# Altium schematic sheet RHR047A_sch3_Processor_5.SchDoc
size 431 x 279 mm; SheetNumber: 3; PageSetup: Record=PageOptions|CenterHorizontal=True|CenterVertical=True|PrintScale=0.96|XCorrection=1.00|YCorrection=1.00|PrintKind=1|BorderSize=5000000|LeftOffset=0|BottomOffset=0|Orientation=2|PaperLength=1000|PaperWidth=1000|Scale=100|PaperSource=258|PrintQuality=600|MediaType=1|DitherType=10|PaperKind=11x17|PrintScaleMode=1; CopyrightDate: 20xx
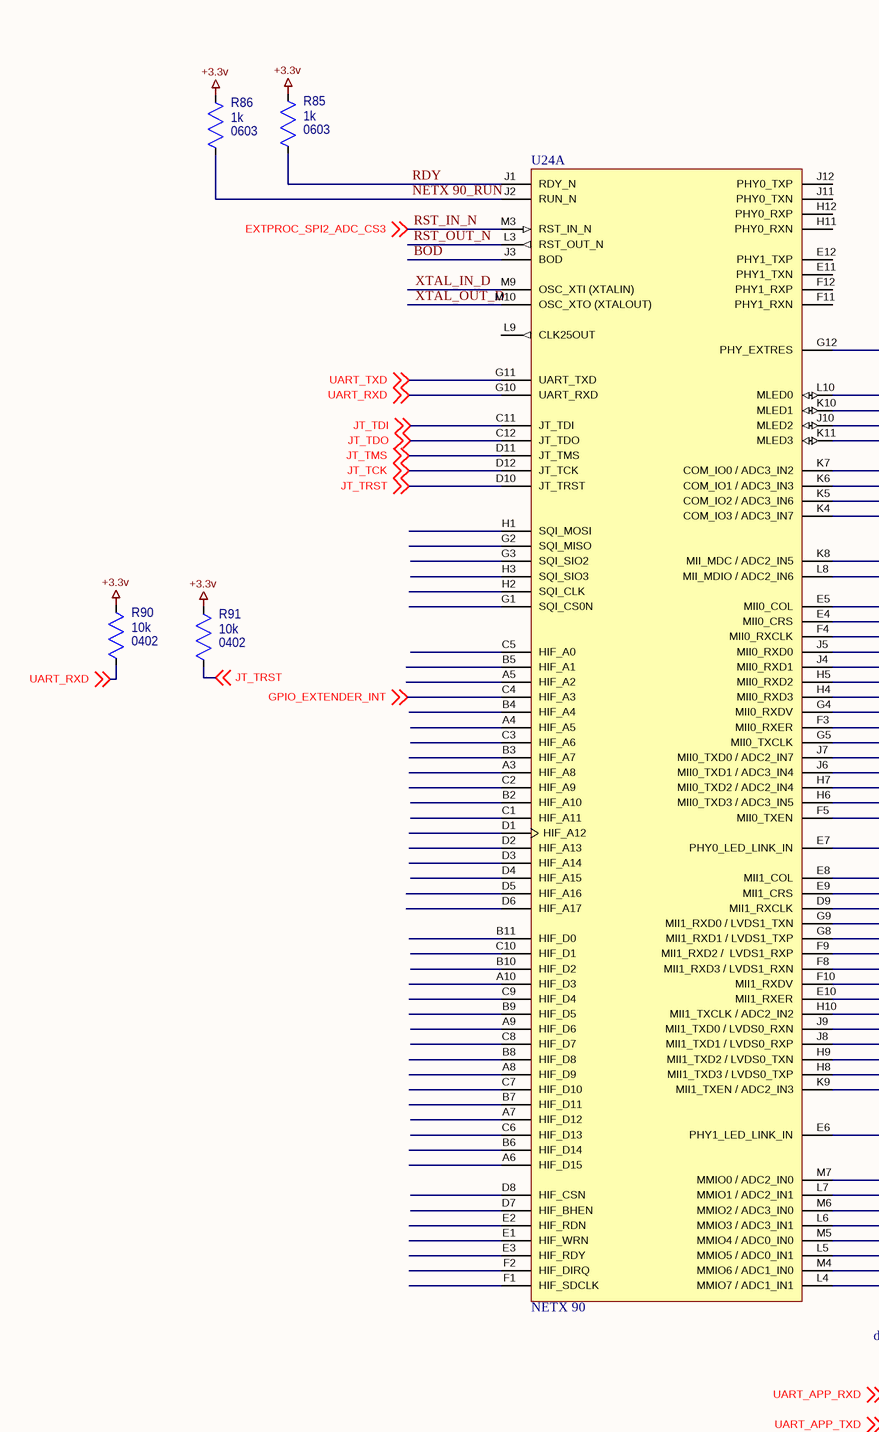
[diagram p0: RHR047A_sch3_Processor_5.SchDoc, left]
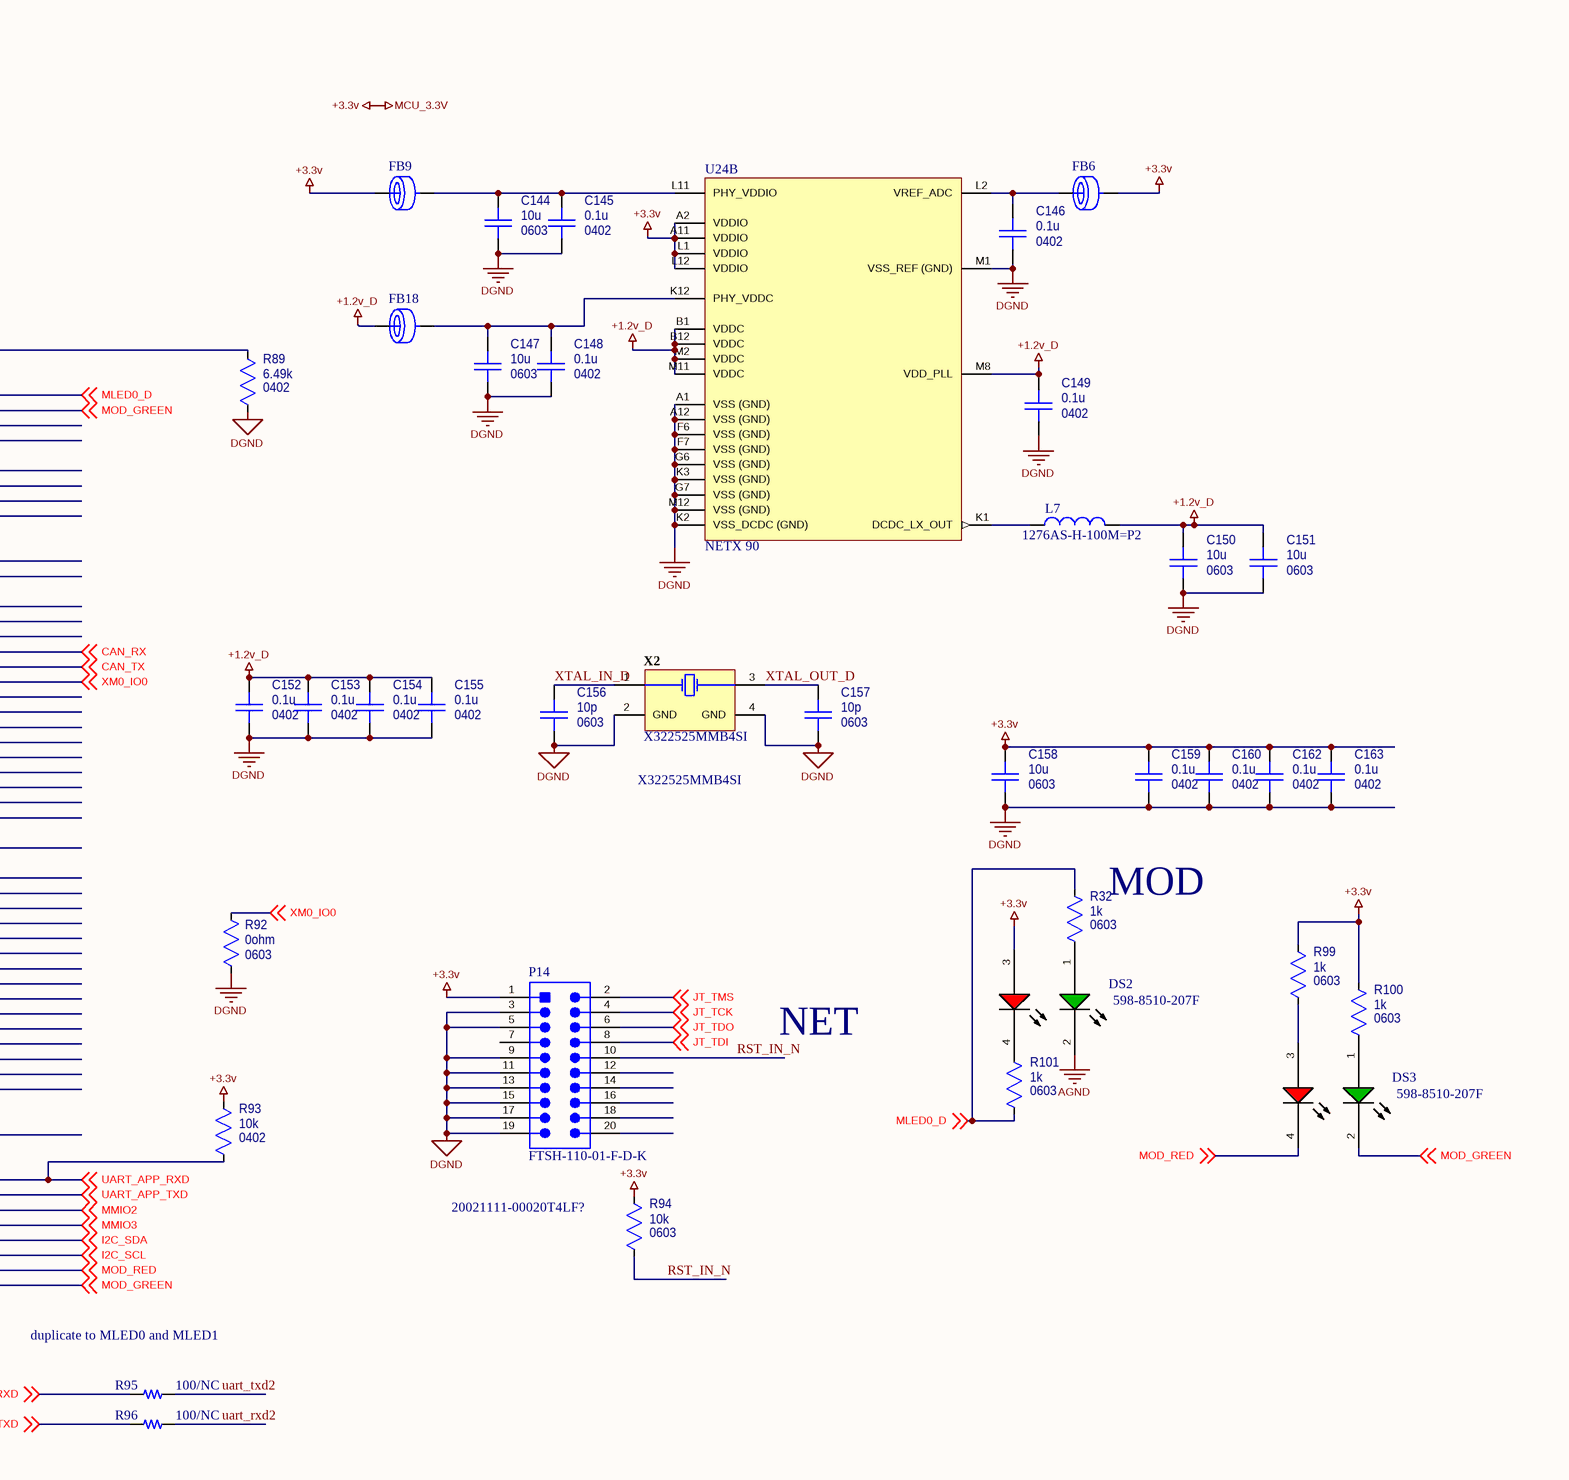
[diagram p1: RHR047A_sch3_Processor_5.SchDoc, right]

## Parts
C144  value 10u  Package: 0603  [CAPC1608X092N_0603]  (hidden comment: Capacitor_0603)
C145  value 0.1u  Package: 0402  [CAPC1005X056N_0402]  (hidden comment: Capacitor_0402)
C146  value 0.1u  Package: 0402  [CAPC1005X056N_0402]  (hidden comment: Capacitor_0402)
C147  value 10u  Package: 0603  [CAPC1608X092N_0603]  (hidden comment: Capacitor_0603)
C148  value 0.1u  Package: 0402  [CAPC1005X056N_0402]  (hidden comment: Capacitor_0402)
C149  value 0.1u  Package: 0402  [CAPC1005X056N_0402]  (hidden comment: Capacitor_0402)
C150  value 10u  Package: 0603  [CAPC1608X092N_0603]  (hidden comment: Capacitor_0603)
C151  value 10u  Package: 0603  [CAPC1608X092N_0603]  (hidden comment: Capacitor_0603)
C152  value 0.1u  Package: 0402  [CAPC1005X056N_0402]  (hidden comment: Capacitor_0402)
C153  value 0.1u  Package: 0402  [CAPC1005X056N_0402]  (hidden comment: Capacitor_0402)
C154  value 0.1u  Package: 0402  [CAPC1005X056N_0402]  (hidden comment: Capacitor_0402)
C155  value 0.1u  Package: 0402  [CAPC1005X056N_0402]  (hidden comment: Capacitor_0402)
C156  value 10p  Package: 0603  [CAPC1608X092N_0603]  (hidden comment: Capacitor_0603)
C157  value 10p  Package: 0603  [CAPC1608X092N_0603]  (hidden comment: Capacitor_0603)
C158  value 10u  Package: 0603  [CAPC1608X092N_0603]  (hidden comment: Capacitor_0603)
C159  value 0.1u  Package: 0402  [CAPC1005X056N_0402]  (hidden comment: Capacitor_0402)
C160  value 0.1u  Package: 0402  [CAPC1005X056N_0402]  (hidden comment: Capacitor_0402)
C162  value 0.1u  Package: 0402  [CAPC1005X056N_0402]  (hidden comment: Capacitor_0402)
C163  value 0.1u  Package: 0402  [CAPC1005X056N_0402]  (hidden comment: Capacitor_0402)
DS2  598-8510-207F  [DIAL-1208-4_V]
DS3  598-8510-207F  [DIAL-1208-4_V]
FB6  FBC0603  [FBC0603]  (value not drawn)
FB9  FBC0603  [FBC0603]  (value not drawn)
FB18  FBC0603  [FBC0603]  (value not drawn)
L7  1276AS-H-100M=P2  [MURA-IND1210_V]
P14  FTSH-110-01-F-D-K  [SMTC-FTSH-110-01-F-D-K_V]
R32  value 1k  Package: 0603  [RESC1608X055N_0603]  (hidden comment: Resistor_0603)
R85  value 1k  Package: 0603  [RESC1608X055N_0603]  (hidden comment: Resistor_0603)
R86  value 1k  Package: 0603  [RESC1608X055N_0603]  (hidden comment: Resistor_0603)
R89  value 6.49k  Package: 0402  [RESC1005X040N_0402]  (hidden comment: Resistor_0402)
R90  value 10k  Package: 0402  [RESC1005X040N_0402]  (hidden comment: Resistor_0402)
R91  value 10k  Package: 0402  [RESC1005X040N_0402]  (hidden comment: Resistor_0402)
R92  value 0ohm  Package: 0603  [RESC1608X055N_0603]  (hidden comment: Resistor_0603)
R93  value 10k  Package: 0402  [RESC1005X040N_0402]  (hidden comment: Resistor_0402)
R94  value 10k  Package: 0603  [RESC1608X055N_0603]  (hidden comment: Resistor_0603)
R95  100/NC  [0603R]
R96  100/NC  [0603R]
R99  value 1k  Package: 0603  [RESC1608X055N_0603]  (hidden comment: Resistor_0603)
R100  value 1k  Package: 0603  [RESC1608X055N_0603]  (hidden comment: Resistor_0603)
R101  value 1k  Package: 0603  [RESC1608X055N_0603]  (hidden comment: Resistor_0603)
U24  NETX 90  [HILSCH-LFBGA144_V]  (parts A,B of 2)
X2  X322525MMB4SI  [TXC-7M-4_V]

## Nets
+1.2v_D: C149.1 C150.1 C151.1 C152.1 C153.1 C154.1 C155.1 FB18.1 L7.2 U24.B1(VDDC) U24.B12(VDDC) U24.M2(VDDC) U24.M8(VDD_PLL) U24.M11(VDDC)
+3.3v: C158.1 C159.1 C160.1 C162.1 C163.1 DS2.3(RED-A) FB6.2 FB9.1 P14.1 R85.2 R86.2 R90.2 R91.2 R93.2 R94.2 R99.2 R100.2 U24.A2(VDDIO) U24.A11(VDDIO) U24.L1(VDDIO) U24.L12(VDDIO)  [also labelled MCU_3.3V]
AGND: DS2.2(GREEN-K)
DGND: C144.2 C145.2 C146.2 C147.2 C148.2 C149.2 C150.2 C151.2 C152.2 C153.2 C154.2 C155.2 C156.2 C157.2 C158.2 C159.2 C160.2 C162.2 C163.2 P14.3 P14.5 P14.9 P14.11 P14.13 P14.15 P14.17 P14.19 R89.1 R92.2 U24.A1(VSS_(GND)) U24.A12(VSS_(GND)) U24.F6(VSS_(GND)) U24.F7(VSS_(GND)) U24.G6(VSS_(GND)) U24.G7(VSS_(GND)) U24.K2(VSS_DCDC_(GND)) U24.K3(VSS_(GND)) U24.M1(VSS_REF_(GND)) U24.M12(VSS_(GND)) X2.2(GND) X2.4(GND)
BOD: U24.J3(BOD)
CAN_RX: U24.J5(MII0_RXD0) ; off-sheet CAN_RX
CAN_TX: U24.J4(MII0_RXD1) ; off-sheet CAN_TX
GPIO_EXTENDER_INT: U24.C4(HIF_A3) ; off-sheet GPIO_EXTENDER_INT
I2C_SCL: U24.L5(MMIO5_/_ADC0_IN1) ; off-sheet I2C_SCL
I2C_SDA: U24.M5(MMIO4_/_ADC0_IN0) ; off-sheet I2C_SDA
JT_TCK: P14.4 U24.D12(JT_TCK) ; off-sheet JT_TCK
JT_TDI: P14.8 U24.C11(JT_TDI) ; off-sheet JT_TDI
JT_TDO: P14.6 U24.C12(JT_TDO) ; off-sheet JT_TDO
JT_TMS: P14.2 U24.D11(JT_TMS) ; off-sheet JT_TMS
JT_TRST: R91.1 U24.D10(JT_TRST) ; off-sheet JT_TRST
MLED0_D: R32.2 R101.1 U24.L10(MLED0) ; off-sheet MLED0_D
MMIO2: U24.M6(MMIO2_/_ADC3_IN0) ; off-sheet MMIO2
MMIO3: U24.L6(MMIO3_/_ADC3_IN1) ; off-sheet MMIO3
MOD_GREEN: DS3.2(GREEN-K) U24.K10(MLED1) U24.L4(MMIO7_/_ADC1_IN1) ; off-sheet MOD_GREEN
MOD_RED: DS3.4(RED-K) U24.M4(MMIO6_/_ADC1_IN0) ; off-sheet MOD_RED
NETX 90_RUN: R86.1 U24.J2(RUN_N)
RDY: R85.1 U24.J1(RDY_N)
RST_IN_N: P14.10 R94.1 U24.M3(RST_IN_N) ; off-sheet EXTPROC_SPI2_ADC_CS3  [also labelled EXTPROC_SPI2_ADC_CS3]
RST_OUT_N: U24.L3(RST_OUT_N)
UART_APP_RXD: R93.1 R95.1 U24.M7(MMIO0_/_ADC2_IN0) ; off-sheet UART_APP_RXD
UART_APP_TXD: R96.1 U24.L7(MMIO1_/_ADC2_IN1) ; off-sheet UART_APP_TXD
UART_RXD: R90.1 U24.G10(UART_RXD) ; off-sheet UART_RXD
uart_rxd2: R96.2
UART_TXD: U24.G11(UART_TXD) ; off-sheet UART_TXD
uart_txd2: R95.2
XM0_IO0: R92.1 U24.H5(MII0_RXD2) ; off-sheet XM0_IO0
XTAL_IN_D: C156.1 U24.M9(OSC_XTI_(XTALIN)) X2.1(X1)
XTAL_OUT_D: C157.1 U24.M10(OSC_XTO_(XTALOUT)) X2.3(X2)
NetC144_1: C144.1 C145.1 FB9.2 U24.L11(PHY_VDDIO)
NetC146_1: C146.1 FB6.1 U24.L2(VREF_ADC)
NetC147_1: C147.1 C148.1 FB18.2 U24.K12(PHY_VDDC)
NetDS2_1: DS2.1(GREEN-A) R32.1
NetDS2_4: DS2.4(RED-K) R101.2
NetDS3_1: DS3.1(GREEN-A) R100.1
NetDS3_3: DS3.3(RED-A) R99.1
NetL7_1: L7.1 U24.K1(DCDC_LX_OUT)
NetR89_2: R89.2 U24.G12(PHY_EXTRES)

Not connected (* = marked no-connect by the designer): P14 7 12 14 16 18 20; U24 A3(HIF_A8) A4(HIF_A5) A5(HIF_A2) A6(HIF_D15) A7(HIF_D12) A8(HIF_D9) A9(HIF_D6) A10(HIF_D3) B2(HIF_A10) B3(HIF_A7) B4(HIF_A4) B5(HIF_A1) B6(HIF_D14) B7(HIF_D11) B8(HIF_D8) B9(HIF_D5) B10(HIF_D2) B11(HIF_D0) C1(HIF_A11) C2(HIF_A9) C3(HIF_A6) C5(HIF_A0) C6(HIF_D13) C7(HIF_D10) C8(HIF_D7) C9(HIF_D4) C10(HIF_D1) D1(HIF_A12) D2(HIF_A13) D3(HIF_A14) D4(HIF_A15) D5(HIF_A16) D6(HIF_A17) D7(HIF_BHEN) D8(HIF_CSN) D9(MII1_RXCLK) E1(HIF_WRN) E2(HIF_RDN) E3(HIF_RDY) E4(MII0_CRS) E5(MII0_COL) E6(PHY1_LED_LINK_IN) E7(PHY0_LED_LINK_IN) E8(MII1_COL) E9(MII1_CRS) E10(MII1_RXER) E11(PHY1_TXN) E12(PHY1_TXP) F1(HIF_SDCLK) F2(HIF_DIRQ) F3(MII0_RXER) F4(MII0_RXCLK) F5(MII0_TXEN) F8(MII1_RXD3_/_LVDS1_RXN) F9(MII1_RXD2_/__LVDS1_RXP) F10(MII1_RXDV) F11(PHY1_RXN) F12(PHY1_RXP) G1(SQI_CS0N) G2(SQI_MISO) G3(SQI_SIO2) G4(MII0_RXDV) G5(MII0_TXCLK) G8(MII1_RXD1_/_LVDS1_TXP) G9(MII1_RXD0_/_LVDS1_TXN) H1(SQI_MOSI) H2(SQI_CLK) H3(SQI_SIO3) H4(MII0_RXD3) H6(MII0_TXD3_/_ADC3_IN5) H7(MII0_TXD2_/_ADC2_IN4) H8(MII1_TXD3_/_LVDS0_TXP) H9(MII1_TXD2_/_LVDS0_TXN) H10(MII1_TXCLK_/_ADC2_IN2) H11(PHY0_RXN) H12(PHY0_RXP) J6(MII0_TXD1_/_ADC3_IN4) J7(MII0_TXD0_/_ADC2_IN7) J8(MII1_TXD1_/_LVDS0_RXP) J9(MII1_TXD0_/_LVDS0_RXN) J10(MLED2) J11(PHY0_TXN) J12(PHY0_TXP) K4(COM_IO3_/_ADC3_IN7) K5(COM_IO2_/_ADC3_IN6) K6(COM_IO1_/_ADC3_IN3) K7(COM_IO0_/_ADC3_IN2) K8(MII_MDC_/_ADC2_IN5) K9(MII1_TXEN_/_ADC2_IN3) K11(MLED3) L8(MII_MDIO_/_ADC2_IN6) L9(CLK25OUT)

## Notes on the sheet
- (near X2) X322525MMB4SI
- (near R32) MOD
- NET
- 20021111-00020T4LF?
- (near R95) duplicate to MLED0 and MLED1
- DWG. TITLE
- FILE NAME:
- OrangePrecision
- DWG. NO.
- REV.
- DATE PRINTED:
- ENG.
- DWN.
- DATE
- SHEET
- OF

## Library data of the parts
C144 C147 C150 C151 C158 = Capacitor_0603: Capacitor, MLCC; Manufacturer: Murata Electronics; PartNumber: GRM188R61A106KE69D; Tolerance: [tol]; TempCo: [tempco]; Voltage Rating: [voltage]; Supplier 1: *; ComponentLink1URL: *; Supplier Part Number 1: *; ComponentLink1Description: Datasheet; SupplierDescription: CAP CER 10UF 10V X5R 0603
C145 C146 C148 C149 C152-C155 C159 C160 C162 C163 = Capacitor_0402: Capacitor, MLCC; Manufacturer: Murata Electronics; PartNumber: GRM155R71C104KA88J; Tolerance: [tol]; TempCo: [tempco]; Voltage Rating: [voltage]; Supplier 1: *; ComponentLink1URL: *; Supplier Part Number 1: *; ComponentLink1Description: Datasheet; SupplierDescription: CAP CER 0.1UF 16V X7R 0402
C156 C157 = Capacitor_0603: Capacitor, MLCC; Manufacturer: Yageo; PartNumber: CC0603KRNPO9BN100; Tolerance: [tol]; TempCo: [tempco]; Voltage Rating: [voltage]; Supplier 1: *; ComponentLink1URL: *; Supplier Part Number 1: *; ComponentLink1Description: Datasheet; SupplierDescription: CAP CER 10PF 50V C0G/NPO 0603
DS2 DS3 = 598-8510-207F: Bi-Color LED, 2.2 V, -40 to 100 degC, 4-Pin SMD (1208), RoHS, Tape and Reel; Manufacturer: Dialight; Dominant Wave Length: 470/525/635nm; Product Length (mm): 1mm; Viewing Angle: 160deg; Number of  Elements: 3; Forward Voltage: 3.4/3.4/2.4V; Rad Hardened: No; Luminous Intensity: 90/120/60mcd; Test Current (It): 20mA; Shape Type: Rectangular; Product Depth (mm): 3.2mm; Chip Material: InGaN/InGaN/AlGaInP; Main Category: ChipLED; Reverse Voltage: 5V; Power Dissipation: 68/68/64W; DELETED: Compliant; Emitting Color: Blue/Green/Red; Mounting Technology: SurfaceMount; Datasheet URL: https://datasheet.ciiva.com/22748/1484480-22748121.pdf; Package Reference: 1208; Packaging: TapeandReel; Lens Dimensions: 2x1x1mm; Datasheet Version: 10/2008; Operating Temperature Classification: Industrial; Type: Bi-Color; Product Height (mm): 1mm; Pin Count: 4; Lum Intensity: 90/120/60mcd; Operating Temp Range: -40Cto100C; Package Type: SMD; Mounting: SurfaceMount; Package Description: 4-Pin Surface Mount Device, Body 3.2 x 1 mm; Forward Current: 20mA; High Brightness: No; Manufacturer URL: http://www.dialight.com/
FB6 FB9 FB18 = FBC0603: Ferrite Bead Chip; Manufacturer: Pulse Electronics Network; PartNumber: PE-0603PFB121ST; Value: 600 Ohms @ 100MHz; SupplierDescription: FERRITE BEAD 600 OHM 0603 1LN
L7 = 1276AS-H-100M=P2: Metal alloy Power Inductor, 10 uH, ±20%, 1210 (3225); Manufacturer: Murata; DC Resistance: 0.71 Ohm; Inductance: 10 uH; Rated Current: 250 mA; ComponentLink1Description: Manufacturer URL; ComponentLink2Description: Datasheet; Mounting Technology: Surface Mount; ComponentLink1URL: http://www.murata.com/; PackageDescription: 2-Pin SMT Inductor, 3.2 x 2.5 mm Body; PackageReference: IND1210; PartNumber: 1276AS-H-100M=P2; ComponentLink2URL: http://www.murata.com/products/catalog/pdf/o05e.pdf#LQH32C
P14 = FTSH-110-01-F-D-K: Male Header, Pitch 1.27 mm, 2 x 10 Position, Height 6.25 mm, -55 to 125 degC, RoHS; Manufacturer: Samtec-Inc.; Number of Positions Loaded: All; Pitch: 0.050"(1.27mm); Number of Positions: 20; Connector Type: Header,Shrouded; Package URL: http://suddendocs.samtec.com/prints/ftsh-1xx-xx-xxx-dv-xxx-xxx-mkt.pdf; Fastening Type: -; Mounting Technology: THT; Packaging: Tube; Contact Mating Length: 0.120"(3.05mm); Row Spacing: 0.050"(1.27mm); Family: RectangularConnectors-Headers,MalePins; Datasheet URL: http://suddendocs.samtec.com/catalog_english/ftsh_smt.pdf; Contact Finish: Gold; Mounting Type: THT; Number of Rows: 2; Series: FTSH; Datasheet Version: F-215 , 02/2016; Color: Black; Contact Finish Thickness: 10μin(0.25μm); Features: -; Contact Type: MalePin; Package Reference: FTSH-110-01-F-D-K; Package Description: Male Header, Pitch 1.27 mm, 2 x 10 Position, Height 6.25 mm; Manufacturer URL: http://www.samtec.com/; Category: Connectors,Interconnects; Termination: Solder
R32 R85 R86 R99-R101 = Resistor_0603: Resistor, Standard; Manufacturer: Yageo; PartNumber: RC0603FR-071KL; Power Rating: [power]; TempCo: [tempco]; Tolerance: tol; ComponentLink1URL: *; ComponentLink1Description: Datasheet
  R32 R99-R101: SupplierDescription: RES 1k OHM 1% 1/10W 0603
  R85 R86: SupplierDescription: RES SMD 1K OHM 1% 1/10W 0603
R89 = Resistor_0402: Resistor, Standard; Manufacturer: Yageo; PartNumber: RC0402FR-076K49L; Power Rating: [power]; TempCo: [tempco]; Tolerance: tol; ComponentLink1URL: *; ComponentLink1Description: Datasheet; SupplierDescription: RES SMD 6.49K OHM 1% 1/16W 0402
R90 R91 R93 = Resistor_0402: Resistor, Standard; Manufacturer: Panasonic; PartNumber: ERJ-2RKF1002X; Power Rating: [power]; TempCo: [tempco]; Tolerance: tol; ComponentLink1URL: *; ComponentLink1Description: Datasheet; SupplierDescription: RES SMD 10K OHM 1% 1/10W 0402
R92 = Resistor_0603: Resistor, Standard; Manufacturer: Yageo; PartNumber: RC0603JR-070RL; Power Rating: [power]; TempCo: [tempco]; Tolerance: tol; ComponentLink1URL: *; ComponentLink1Description: Datasheet; SupplierDescription: RES SMD 0 OHM JUMPER 1/10W 0603
R94 = Resistor_0603: Resistor, Standard; Manufacturer: Yageo; PartNumber: RC0603FR-0710KL; Power Rating: [power]; TempCo: [tempco]; Tolerance: tol; ComponentLink1URL: *; ComponentLink1Description: Datasheet; SupplierDescription: RES SMD 10K OHM 1% 1/10W 0603
R95 R96 = R
U24 = NETX 90: Smallest Multiprotocol SoC with Additional Cortex-M4 Application Processor, 1024 KB Flash, 576 KB Internal RAM, 144-pin LFBGA, -40 to 85 degC, Tray; A/D Converter: 3x12-bit (21 Channel); D/A Converter: 2x12-bit (2 Channel); I/Os (High Current): 112; Internal RAM Size (kB): 96; Core: ARM Cortex-M4; FLASH Size (Prog) (kB): 1024; Operating Frequency(F) (Processor speed) (MHz): 72; PartNumber: NETX 90; Mounting Technology: Surface Mount; PackageReference: LFBGA144; ComponentLink2Description: Datasheet; DatasheetVersion: Rev. 3; PackageDescription: 144-Ball Low Profile Fine Pitch BGA, 10 x 10 x 1.7 mm Body, 0.8 mm Pitch; Packing: Tray; ComponentLink1URL: https://www.hilscher.com/; ComponentLink1Description: Manufacturer URL; ComponentLink2URL: https://www.hilscher.com/fileadmin/cms_upload/en-US/Resources/pdf/netX-90_Datasheet_10-2019_GB.pdf
X2 = 7M-25.000MEEQ-T: Seam Crystal, 7M Series, 3 pF, -40 to 85 degC, 4-Pin SMD, RoHS, Tape and Reel; Manufacturer: TXC; ESR (Equivalent Series Resistance): 60Ohm; Operating Mode: Fundamental; Frequency Stability: ±10ppm; Other Names: 887-1329-1; Catalog Drawings: 7MSeriesTop / 7MSeriesBottom / 7MSeriesSide / 7MSeriesCircuit; Frequency: 25MHz; Load Capacitance: 10pF; Mounting Technology: SurfaceMount; Type: MHzCrystal; Height: 0.031"(0.80mm); Mounting Type: SurfaceMount; Series: 7M; Package Reference: 7M-4; Size / Dimension: 0.126"Lx0.098"W(3.20mmx2.50mm); Package Description: 4-Pin Surface Mount Device, Body 3.2 x 2.5 mm; Datasheet URL: http://datasheet.octopart.com/7M-27.120MEEQ-T-TXC-datasheet-10979173.pdf; Operating Temperature: -20°C~70°C; Datasheet Version: 02/2010; Family: Crystals; Dynamic Catalog: 7MSeries; Packaging: CutTape(CT); Manufacturer URL: http://www.txccorp.com/; Standard Package: 1; Category: CrystalsandOscillators; Frequency Tolerance: ±10ppm; Package / Case: 4-SMD,NoLead(DFN,LCC)